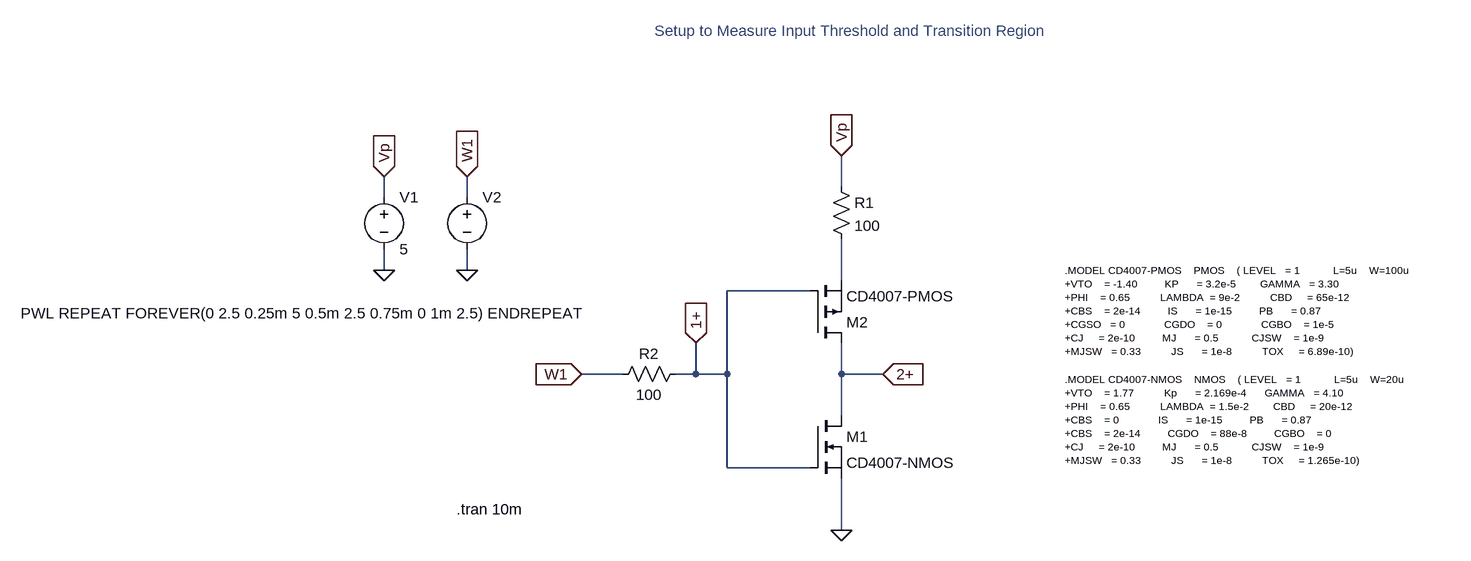
[diagram p0: schematic measure_thres_trans_ltspice.asc]
measure_thres_trans_ltspice.asc, the LTspice schematic file:
Version 4
SHEET 1 1416 680
WIRE 160 -240 160 -288
WIRE -544 -224 -544 -256
WIRE -416 -224 -416 -256
WIRE -544 -112 -544 -144
WIRE -416 -112 -416 -144
WIRE 160 -96 160 -160
WIRE 112 -80 -16 -80
WIRE -176 48 -240 48
WIRE -64 48 -64 0
WIRE -64 48 -96 48
WIRE -16 48 -16 -80
WIRE -16 48 -64 48
WIRE 160 48 160 0
WIRE 224 48 160 48
WIRE 160 112 160 48
WIRE -16 192 -16 48
WIRE 112 192 -16 192
WIRE 160 288 160 208
FLAG -240 48 W1
IOPIN -240 48 In
FLAG 224 48 2+
IOPIN 224 48 In
FLAG 160 -288 Vp
IOPIN 160 -288 In
FLAG 160 288 0
FLAG -544 -112 0
FLAG -416 -112 0
FLAG -544 -256 Vp
IOPIN -544 -256 In
FLAG -416 -256 W1
IOPIN -416 -256 In
FLAG -64 0 1+
IOPIN -64 0 In
SYMBOL nmos 112 112 R0
SYMATTR InstName M1
SYMATTR Value CD4007-NMOS
SYMBOL pmos 112 0 M180
SYMATTR InstName M2
SYMATTR Value CD4007-PMOS
SYMBOL res 144 -256 R0
SYMATTR InstName R1
SYMATTR Value 100
SYMBOL res -80 32 R90
WINDOW 0 0 56 VBottom 2
WINDOW 3 32 56 VTop 2
SYMATTR InstName R2
SYMATTR Value 100
SYMBOL voltage -544 -240 R0
WINDOW 123 0 0 Left 0
WINDOW 39 0 0 Left 0
SYMATTR InstName V1
SYMATTR Value 5
SYMBOL voltage -416 -240 R0
WINDOW 3 -687 194 Left 2
WINDOW 123 0 0 Left 0
WINDOW 39 0 0 Left 0
SYMATTR Value PWL REPEAT FOREVER(0 2.5 0.25m 5 0.5m 2.5 0.75m 0 1m 2.5) ENDREPEAT
SYMATTR InstName V2
TEXT 504 -112 Left 1 !.MODEL CD4007-PMOS    PMOS    ( LEVEL   = 1           L=5u    W=100u                \n+VTO    = -1.40         KP      = 3.2e-5        GAMMA   = 3.30  \n+PHI    = 0.65          LAMBDA  = 9e-2          CBD     = 65e-12\n+CBS    = 2e-14         IS      = 1e-15         PB      = 0.87\n+CGSO   = 0             CGDO    = 0             CGBO    = 1e-5\n+CJ     = 2e-10         MJ      = 0.5           CJSW    = 1e-9\n+MJSW   = 0.33          JS      = 1e-8          TOX     = 6.89e-10)
TEXT 504 56 Left 1 !.MODEL CD4007-NMOS    NMOS    ( LEVEL   = 1           L=5u    W=20u             \n+VTO    = 1.77          Kp      = 2.169e-4      GAMMA   = 4.10  \n+PHI    = 0.65          LAMBDA  = 1.5e-2        CBD     = 20e-12\n+CBS    = 0             IS      = 1e-15         PB      = 0.87\n+CBS    = 2e-14         CGDO    = 88e-8         CGBO    = 0\n+CJ     = 2e-10         MJ      = 0.5           CJSW    = 1e-9\n+MJSW   = 0.33          JS      = 1e-8          TOX     = 1.265e-10)
TEXT -432 256 Left 2 !.tran 10m
TEXT -128 -480 Left 2 ;Setup to Measure Input Threshold and Transition Region

The netlist it stands for:
* measure_thres_trans_ltspice.asc
M1 2+ 1+ 0 0 CD4007-NMOS
M2 2+ 1+ N001 N001 CD4007-PMOS
R1 Vp N001 100
R2 1+ W1 100
V1 Vp 0 5
V2 W1 0 PWL REPEAT FOREVER(0 2.5 0.25m 5 0.5m 2.5 0.75m 0 1m 2.5) ENDREPEAT
.model NMOS NMOS
.model PMOS PMOS
.lib standard.mos
.MODEL CD4007-PMOS    PMOS    ( LEVEL   = 1           L=5u    W=100u
+VTO    = -1.40         KP      = 3.2e-5        GAMMA   = 3.30
+PHI    = 0.65          LAMBDA  = 9e-2          CBD     = 65e-12
+CBS    = 2e-14         IS      = 1e-15         PB      = 0.87
+CGSO   = 0             CGDO    = 0             CGBO    = 1e-5
+CJ     = 2e-10         MJ      = 0.5           CJSW    = 1e-9
+MJSW   = 0.33          JS      = 1e-8          TOX     = 6.89e-10)
.MODEL CD4007-NMOS    NMOS    ( LEVEL   = 1           L=5u    W=20u
+VTO    = 1.77          Kp      = 2.169e-4      GAMMA   = 4.10
+PHI    = 0.65          LAMBDA  = 1.5e-2        CBD     = 20e-12
+CBS    = 0             IS      = 1e-15         PB      = 0.87
+CBS    = 2e-14         CGDO    = 88e-8         CGBO    = 0
+CJ     = 2e-10         MJ      = 0.5           CJSW    = 1e-9
+MJSW   = 0.33          JS      = 1e-8          TOX     = 1.265e-10)
.tran 10m
* Setup to Measure Input Threshold and Transition Region
.backanno
.end